# Altium schematic sheet Kit_Rele_v1_SCH.SchDoc
size A4
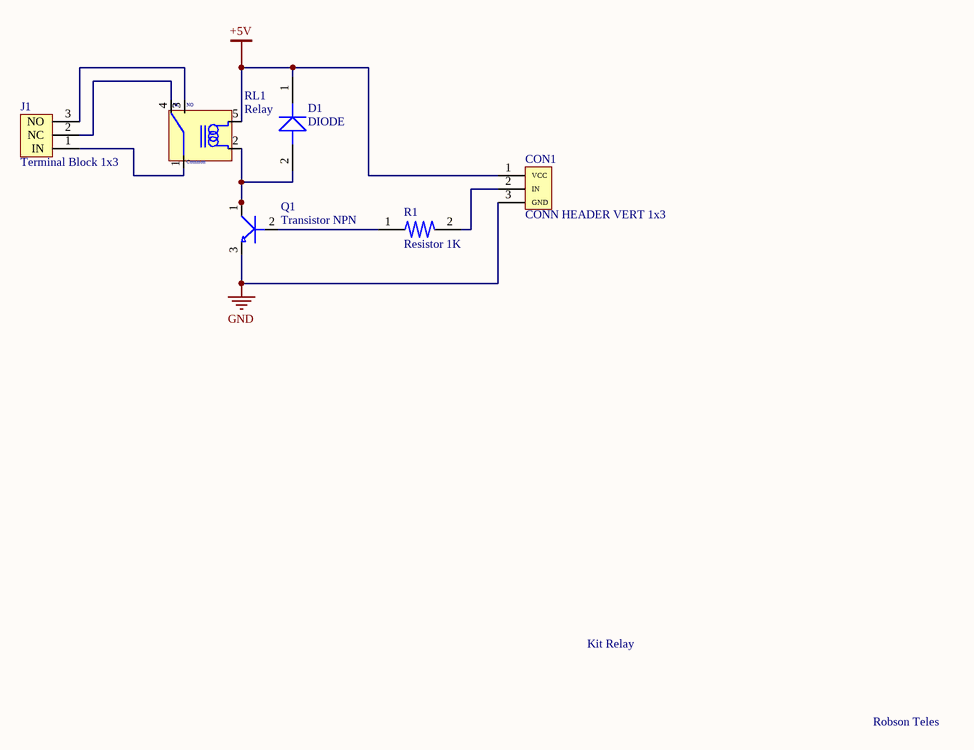
[diagram p0: Kit_Rele_v1_SCH.SchDoc]

## Parts
CON1  CONN HEADER VERT 1x3  [CONN HEADER]
D1  DIODE  [DIODE BAT54]
J1  Terminal Block 1x3  [Terminal Block]
Q1  Transistor NPN  [Transistor SOT-23]
R1  Resistor 1K  [R1206]
RL1  Relay  [Relay]

## Nets
+5V: CON1.1(VCC) D1.1 RL1.5
GND: CON1.3(GND) Q1.3
NetCON1_2: CON1.2(IN) R1.2
NetD1_2: D1.2 Q1.1 RL1.2
NetJ1_1: J1.1(IN) RL1.1
NetJ1_2: J1.2(NC) RL1.4
NetJ1_3: J1.3(NO) RL1.3
NetQ1_2: Q1.2 R1.1

## Notes on the sheet
- Kit Relay
- Robson Teles
- (in symbol G5LE-1-36DC5) NC; NO; Common

## Library data of the parts
CON1 = 61300311121: Board-To-Board Connector, Vertical, Wr-Phd Series, Through Hole, Header, 3, 2.54 Mm; Manufacturer: Wurth Electronics; Number of Positions: 3; Gender: Male; Connector Type: Male Pin; Pitch: 0.1inch; Cotegory: Connectors; Supplier 1: Digi-Key; Manufacturer Part Number: 61300311121; Stock 1: 109382; Pricing 1: 1=0.13, 10=0.106, 25=0.088, 50=0.074, 100=0.067, 1000=0.061 (USD); Mount: Through Hole; Contact Plating: Gold; Contact Material: Copper; Color: Black; Number of Rows: 1; Packaging: Bulk; Termination: Solder; Number of Contacts: 3; Contact Mating Length: 0.236inch; REACH SVHC: Unknown; Lead Free: Lead Free; ComponentLink1URL: http://www.farnell.com/cad/1737268.pdf?src-supplier=Element14; ComponentLink1Description: http://www.farnell.com/cad/1737268.pdf?src-supplier=Element14; ComponentLink2URL: https://katalog.we-online.de/em/datasheet/6130xx11121.pdf?src-supplier=Digi-Key; ComponentLink2Description: https://katalog.we-online.de/em/datasheet/6130xx11121.pdf?src-supplier=Digi-Key; Supplier Part Number 1: 732-5316-ND
D1 = BAT54HT1G: Small Signal Schottky Diode, Single, 30 V, 200 mA, 800 mV, 600 mA, 150 C ;RoHS Compliant: Yes; Manufacturer: ON Semiconductor / Fairchild; Forward Voltage: 800mV; Forward Current: 200mA; Recovery Time: 5ns; Max Repetitive Reverse Voltage (Vrrm): 30V; Peak Non-Repetitive Surge Current: 600mA; Peak Reverse Current: 2uA; Power Dissipation: 200mW; Polarity: Standard; Capacitance: 10pF; Supplier 1: Digi-Key; Manufacturer Part Number: BAT54HT1G; Stock 1: 221756; Pricing 1: 1=0.2, 10=0.181, 25=0.1724, 100=0.0759, 500=0.05962, 1000=0.0414 (USD); Mount: Surface Mount; Number of Pins: 2; Contact Plating: Tin,Matte; Min Operating Temperature: -55°C; Max Operating Temperature: 150°C; Packaging: Tape and Reel; Package Quantity: 3000; Average Rectified Current: 200mA; Reverse Recovery Time: 5ns; Max Forward Surge Current (Ifsm): 600mA; Element Configuration: Single; Max Reverse Voltage (DC): 30V; Max Surge Current: 600mA; Voltage Rating (DC): 30V; Current Rating: 200mA; Output Current: 200mA; Reverse Voltage: 30V; Max Reverse Leakage Current: 2uA; Length: 1.8mm; Height: 1mm; Width: 1.35mm; Radiation Hardening: No; Lead Free: Lead Free; REACH SVHC: No SVHC; ComponentLink1URL: http://www.fairchildsemi.com/datasheets/BA/BAT54HT1G.pdf?src-supplier=Digi-Key; ComponentLink1Description: http://www.fairchildsemi.com/datasheets/BA/BAT54HT1G.pdf?src-supplier=Digi-Key; ComponentLink2URL: http://www.farnell.com/datasheets/2251626.pdf?src-supplier=Element14; ComponentLink2Description: http://www.farnell.com/datasheets/2251626.pdf?src-supplier=Element14; ComponentLink3URL: http://www.jameco.com/Jameco/Products/ProdDS/806549.pdf?src-supplier=Jameco; ComponentLink3Description: http://www.jameco.com/Jameco/Products/ProdDS/806549.pdf?src-supplier=Jameco; ComponentLink4URL: http://www.farnell.com/datasheets/2251626.pdf?src-supplier=Newark; ComponentLink4Description: http://www.farnell.com/datasheets/2251626.pdf?src-supplier=Newark; ComponentLink5URL: http://www.mouser.com/ds/2/149/BAT54HT1G-104602.pdf?src-supplier=Mouser; ComponentLink5Description: http://www.mouser.com/ds/2/149/BAT54HT1G-104602.pdf?src-supplier=Mouser; ComponentLink6URL: http://www.farnell.com/datasheets/1727620.pdf?src-supplier=Element14; ComponentLink6Description: http://www.farnell.com/datasheets/1727620.pdf?src-supplier=Element14; ComponentLink7URL: https://media.digikey.com/pdf/Data%20Sheets/Fairchild%20PDFs/BAT54HT1G_Rev_1.2.pdf?src-supplier=Avnet; ComponentLink7Description: https://media.digikey.com/pdf/Data%20Sheets/Fairchild%20PDFs/BAT54HT1G_Rev_1.2.pdf?src-supplier=Avnet; ComponentLink8URL: http://www.onsemi.com/pub/Collateral/BAT54HT1-D.PDF?src-supplier=Avnet; ComponentLink8Description: http://www.onsemi.com/pub/Collateral/BAT54HT1-D.PDF?src-supplier=Avnet; ComponentLink9URL: http://www.onsemi.com/pub/Collateral/BAT54HT1-D.PDF?src-supplier=Digi-Key; ComponentLink9Description: http://www.onsemi.com/pub/Collateral/BAT54HT1-D.PDF?src-supplier=Digi-Key; ComponentLink10URL: http://uk.rs-online.com/webdocs/11a6/0900766b811a63a9.pdf?src-supplier=RSComponents; ComponentLink10Description: http://uk.rs-online.com/webdocs/11a6/0900766b811a63a9.pdf?src-supplier=RSComponents; ComponentLink11URL: https://media.digikey.com/pdf/Data%20Sheets/Fairchild%20PDFs/BAT54HT1G_Rev_1.2.pdf?src-supplier=Mouser; ComponentLink11Description: https://media.digikey.com/pdf/Data%20Sheets/Fairchild%20PDFs/BAT54HT1G_Rev_1.2.pdf?src-supplier=Mouser; ComponentLink12URL: http://www.fairchildsemi.com/ds/BA/BAT54HT1G.pdf?src-supplier=Future+Electronics; ComponentLink12Description: http://www.fairchildsemi.com/ds/BA/BAT54HT1G.pdf?src-supplier=Future+Electronics; ComponentLink13URL: http://www.produktinfo.conrad.com/datenblaetter/1200000-1299999/001262925-da-01-en-DIODE_SCHOTTKY_30V_BAT54HT1G_SOD_323_FSC.pdf?src-supplier=Conrad; ComponentLink13Description: http://www.produktinfo.conrad.com/datenblaetter/1200000-1299999/001262925-da-01-en-DIODE_SCHOTTKY_30V_BAT54HT1G_SOD_323_FSC.pdf?src-supplier=Conrad; Supplier Part Number 1: BAT54HT1GOSCT-ND; Category: Diode
J1 = 1935174: PHOENIX CONTACT - PT1,5/3-5.0-H - Wire-To-Board Terminal Block, 5 mm, 3 Ways, 26 AWG, 16 AWG, 1.5 mm², Screw; Max Current Rating: 16A; Voltage Rating: 250V; Current Rating: 17.5A; Number of Positions: 3; Number of Levels: 1; Current: 18A; Voltage: 300V; Voltage Rating (DC): 320V; Wire Gauge (Max): 26AWG; Wire Gauge (Min): 12AWG; Pitch: 5mm; Approvals: UL,VDE,CB; Supplier 1: Digi-Key; Manufacturer: Phoenix Contact; Manufacturer Part Number: 1935174; Stock 1: 27165; Pricing 1: 1=0.6, 10=0.58, 50=0.5544, 100=0.5393, 250=0.504, 500=0.46368, 1000=0.4284, 2500=0.42838 (USD); Mount: Through Hole; Number of Pins: 3; Weight: 0.100531oz; Color: Green; Housing Material: Polyamide; Contact Material: Copper,Tin; Material: Nylon; Housing Color: Green; Insulation Material: Nylon; Package Quantity: 250; Packaging: Bulk; Termination: Solder; Number of Contacts: 3; Orientation: Straight; Number of Poles: 3; Number of Rows: 1; Max Supply Voltage: 250V; Number of Positions Per Level: 3; Number of Circuits: 3; Length: 9mm; Height: 11.3mm; Width: 15mm; Depth: 9mm; Wire/Cable Gauge: 26AWG; Stripping Length: 5mm; Radiation Hardening: No; REACH SVHC: Unknown; Lead Free: Lead Free; Flammability Rating: UL94 V-0; ComponentLink1URL: https://media.digikey.com/pdf/Data%20Sheets/Phoenix%20Contact%20PDFs/1935174.pdf?src-supplier=Digi-Key; ComponentLink1Description: https://media.digikey.com/pdf/Data%20Sheets/Phoenix%20Contact%20PDFs/1935174.pdf?src-supplier=Digi-Key; ComponentLink2URL: https://www.verical.com/server-webapp/html/getDatasheet?partID=212213&src-supplier=Verical; ComponentLink2Description: https://www.verical.com/server-webapp/html/getDatasheet?partID=212213&src-supplier=Verical; ComponentLink3URL: https://produktinfo.conrad.com/datenblaetter/725000-749999/744167-da-01-en-PRINTKLEMME_PT_1_5__3_5_0_H.pdf?src-supplier=Conrad; ComponentLink3Description: https://produktinfo.conrad.com/datenblaetter/725000-749999/744167-da-01-en-PRINTKLEMME_PT_1_5__3_5_0_H.pdf?src-supplier=Conrad; Supplier Part Number 1: 277-1578-ND; Category: Connectors
Q1 = MMBT3904-TP: TRANS NPN 40V 0.2A SOT23; Manufacturer: MCC; Max Power Dissipation: 350mW; Number of Elements: 1; hFE Min: 40; Frequency: 300MHz; Max Collector Current: 200mA; Collector Base Voltage (VCBO): 60V; Emitter Base Voltage (VEBO): 6V; Collector Emitter Saturation Voltage: 300mV; Element Configuration: Single; Current Rating: 100mA; Supplier 1: Digi-Key; Manufacturer Part Number: MMBT3904-TP; Stock 1: 530270; Pricing 1: 1=0.1, 10=0.076, 25=0.0724, 100=0.0319, 500=0.02506, 1000=0.0174 (USD); Mount: Surface Mount; Case/Package: SOT-23; Number of Pins: 3; Min Operating Temperature: -55°C; Max Operating Temperature: 150°C; Package Quantity: 1; Collector Emitter Voltage (VCEO): 40V; Packaging: Tape and Reel; Transition Frequency: 300MHz; Collector Emitter Breakdown Voltage: 40V; Polarity: NPN; Max Breakdown Voltage: 40V; Power Dissipation: 350mW; Max Frequency: 300MHz; Gain Bandwidth Product: 300MHz; Voltage Rating (DC): 40V; Length: 3.04mm; Height: 1.12mm; Width: 1.4mm; Radiation Hardening: No; Lead Free: Lead Free; ComponentLink1URL: http://www.mccsemi.com/up_pdf/MMBT3904(SOT-23).pdf?src-supplier=Digi-Key; ComponentLink1Description: http://www.mccsemi.com/up_pdf/MMBT3904(SOT-23).pdf?src-supplier=Digi-Key; ComponentLink2URL: http://www.alliedelec.com/images/products/datasheets/bm/MCC/70055699.pdf?src-supplier=Allied+Electronics; ComponentLink2Description: http://www.alliedelec.com/images/products/datasheets/bm/MCC/70055699.pdf?src-supplier=Allied+Electronics; ComponentLink3URL: http://www.mccsemi.com/up_pdf/MMBT3904T(SOT-523).PDF?src-supplier=Future+Electronics; ComponentLink3Description: http://www.mccsemi.com/up_pdf/MMBT3904T(SOT-523).PDF?src-supplier=Future+Electronics; ComponentLink4URL: http://www.mouser.com/ds/2/258/MMBT3904(SOT-23)-350032.pdf?src-supplier=Mouser; ComponentLink4Description: http://www.mouser.com/ds/2/258/MMBT3904(SOT-23)-350032.pdf?src-supplier=Mouser; ComponentLink5URL: https://www.verical.com/server-webapp/html/getDatasheet?partID=251950&src-supplier=Verical; ComponentLink5Description: https://www.verical.com/server-webapp/html/getDatasheet?partID=251950&src-supplier=Verical; Supplier Part Number 1: MMBT3904TPMSDKR-ND; Category: Transistor
R1 = RC1206JR-071KL: RES SMD 1K OHM 5% 1/4W 1206; Manufacturer: Yageo; Resistance: 1kR; Power Rating: 250mW; Voltage Rating: 200V; Temperature Coefficient: 100ppm/°C; Supplier 1: Digi-Key; Manufacturer Part Number: RC1206JR-071KL; Stock 1: 2036007; Pricing 1: 1=0.1, 10=0.059, 100=0.024, 1000=0.01079, 2500=0.00936 (USD); Case/Package: 1206; Case Code (Metric): 3216; Case Code (Imperial): 1206; Min Operating Temperature: -55°C; Max Operating Temperature: 155°C; Package Quantity: 1; Tolerance: 5%; Packaging: Tape and Reel; Composition: Thick Film; Number of Terminations: 2; Termination: SMD/SMT; Military Standard: Not; Max Power Dissipation: 250mW; Length: 3.1mm; Height: 0.026inch; Width: 0.063inch; Depth: 1.6mm; REACH SVHC: Unknown; Lead Free: Lead Free; ComponentLink1URL: http://www.yageo.com/documents/recent/PYu-RC_Group_51_RoHS_L_10.pdf?src-supplier=Digi-Key; ComponentLink1Description: http://www.yageo.com/documents/recent/PYu-RC_Group_51_RoHS_L_10.pdf?src-supplier=Digi-Key; ComponentLink2URL: http://www.yageo.com/documents/recent/PYu-RC_Group_51_RoHS_L_9.pdf?src-supplier=Digi-Key; ComponentLink2Description: http://www.yageo.com/documents/recent/PYu-RC_Group_51_RoHS_L_9.pdf?src-supplier=Digi-Key; Supplier Part Number 1: 311-1.0KERDKR-ND; Category: Chip Resistor - Surface Mount
RL1 = G5LE-1-36DC5: RELAY GEN PURPOSE SPDT 10A 5V; Manufacturer: Omron; Coil Current: 72mA; Operate Time: 10ms; Release Time: 5ms; Coil Power: 360mW; Coil Resistance: 70R; Max Voltage Rating (AC): 250V; Max Voltage Rating (DC): 125V; Relay Type: General Purpose; Coil Type: Non-Latching; Supplier 1: Digi-Key; Manufacturer Part Number: G5LE-1-36DC5; Stock 1: 186; Pricing 1: 1=1.45, 10=1.361, 25=1.21, 50=1.1494, 100=1.0888, 250=0.96784, 500=0.90736, 1000=0.84686, 5000=0.81662 (USD); Mount: Through Hole; Number of Pins: 5; Weight: 12g; Contact Material: Tin,Silver; Min Operating Temperature: -25°C; Max Operating Temperature: 85°C; Package Quantity: 500; Packaging: Tray; Throw Configuration: SPDT; Termination: PC Pin; Coil Voltage (DC): 5V; Contact Current Rating: 10A; Max Current Rating: 10A; ComponentLink1URL: https://omronfs.omron.com/en_US/ecb/products/pdf/en-g5le.pdf?src-supplier=Digi-Key; ComponentLink1Description: https://omronfs.omron.com/en_US/ecb/products/pdf/en-g5le.pdf?src-supplier=Digi-Key; Supplier Part Number 1: G5LE-1-36DC5-ND; Category: Relays